# EasyEDA Pro project ProProject_训练营23_2023-12-06.epro, board PCB_PCB_不带频谱时钟_2_2023-11-23_1
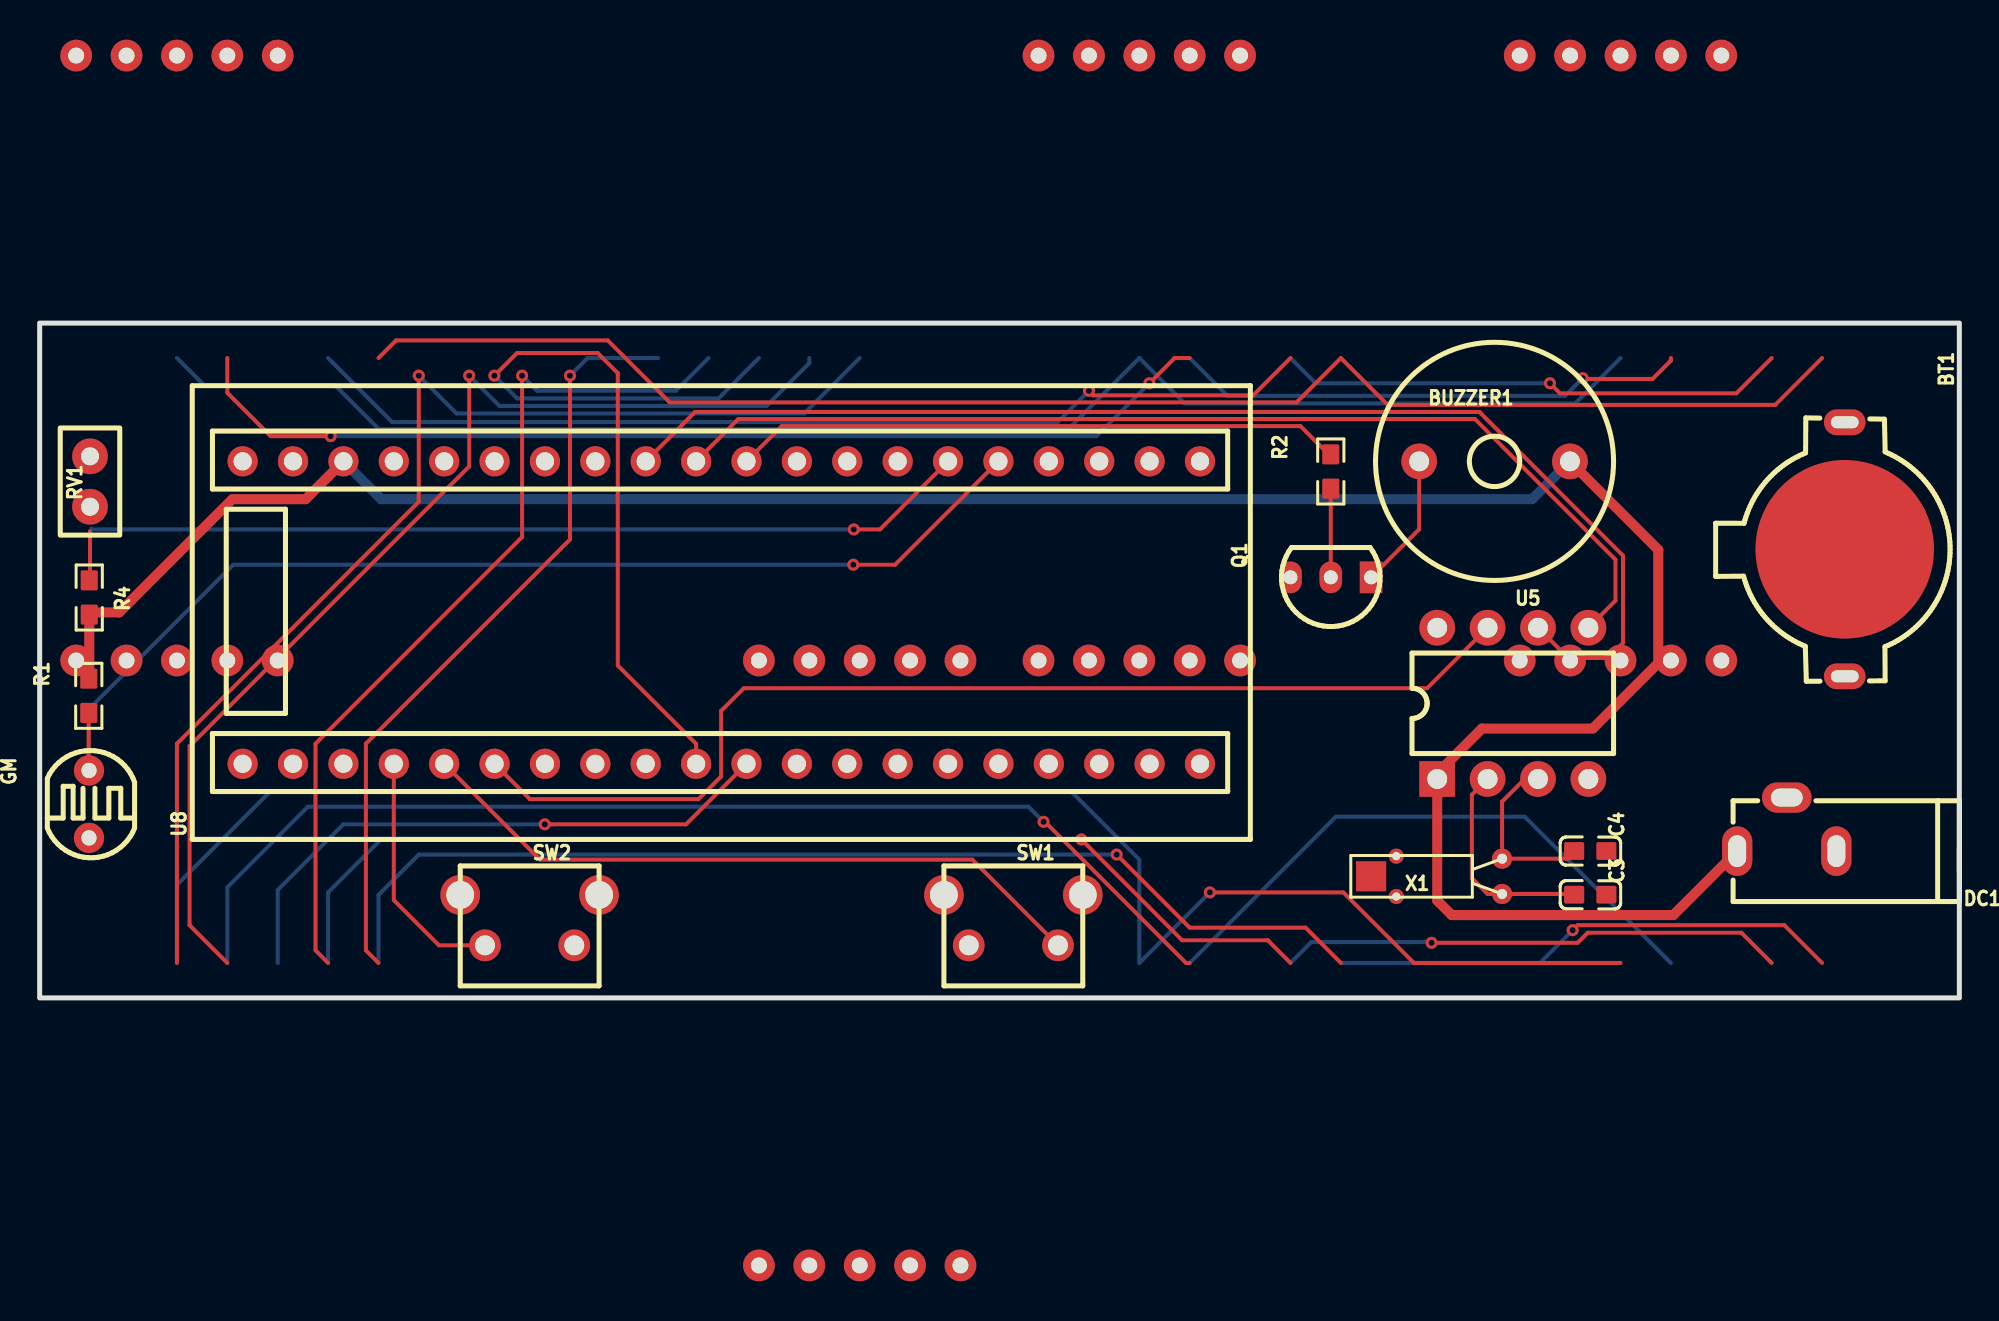
[diagram p1: board, top side]
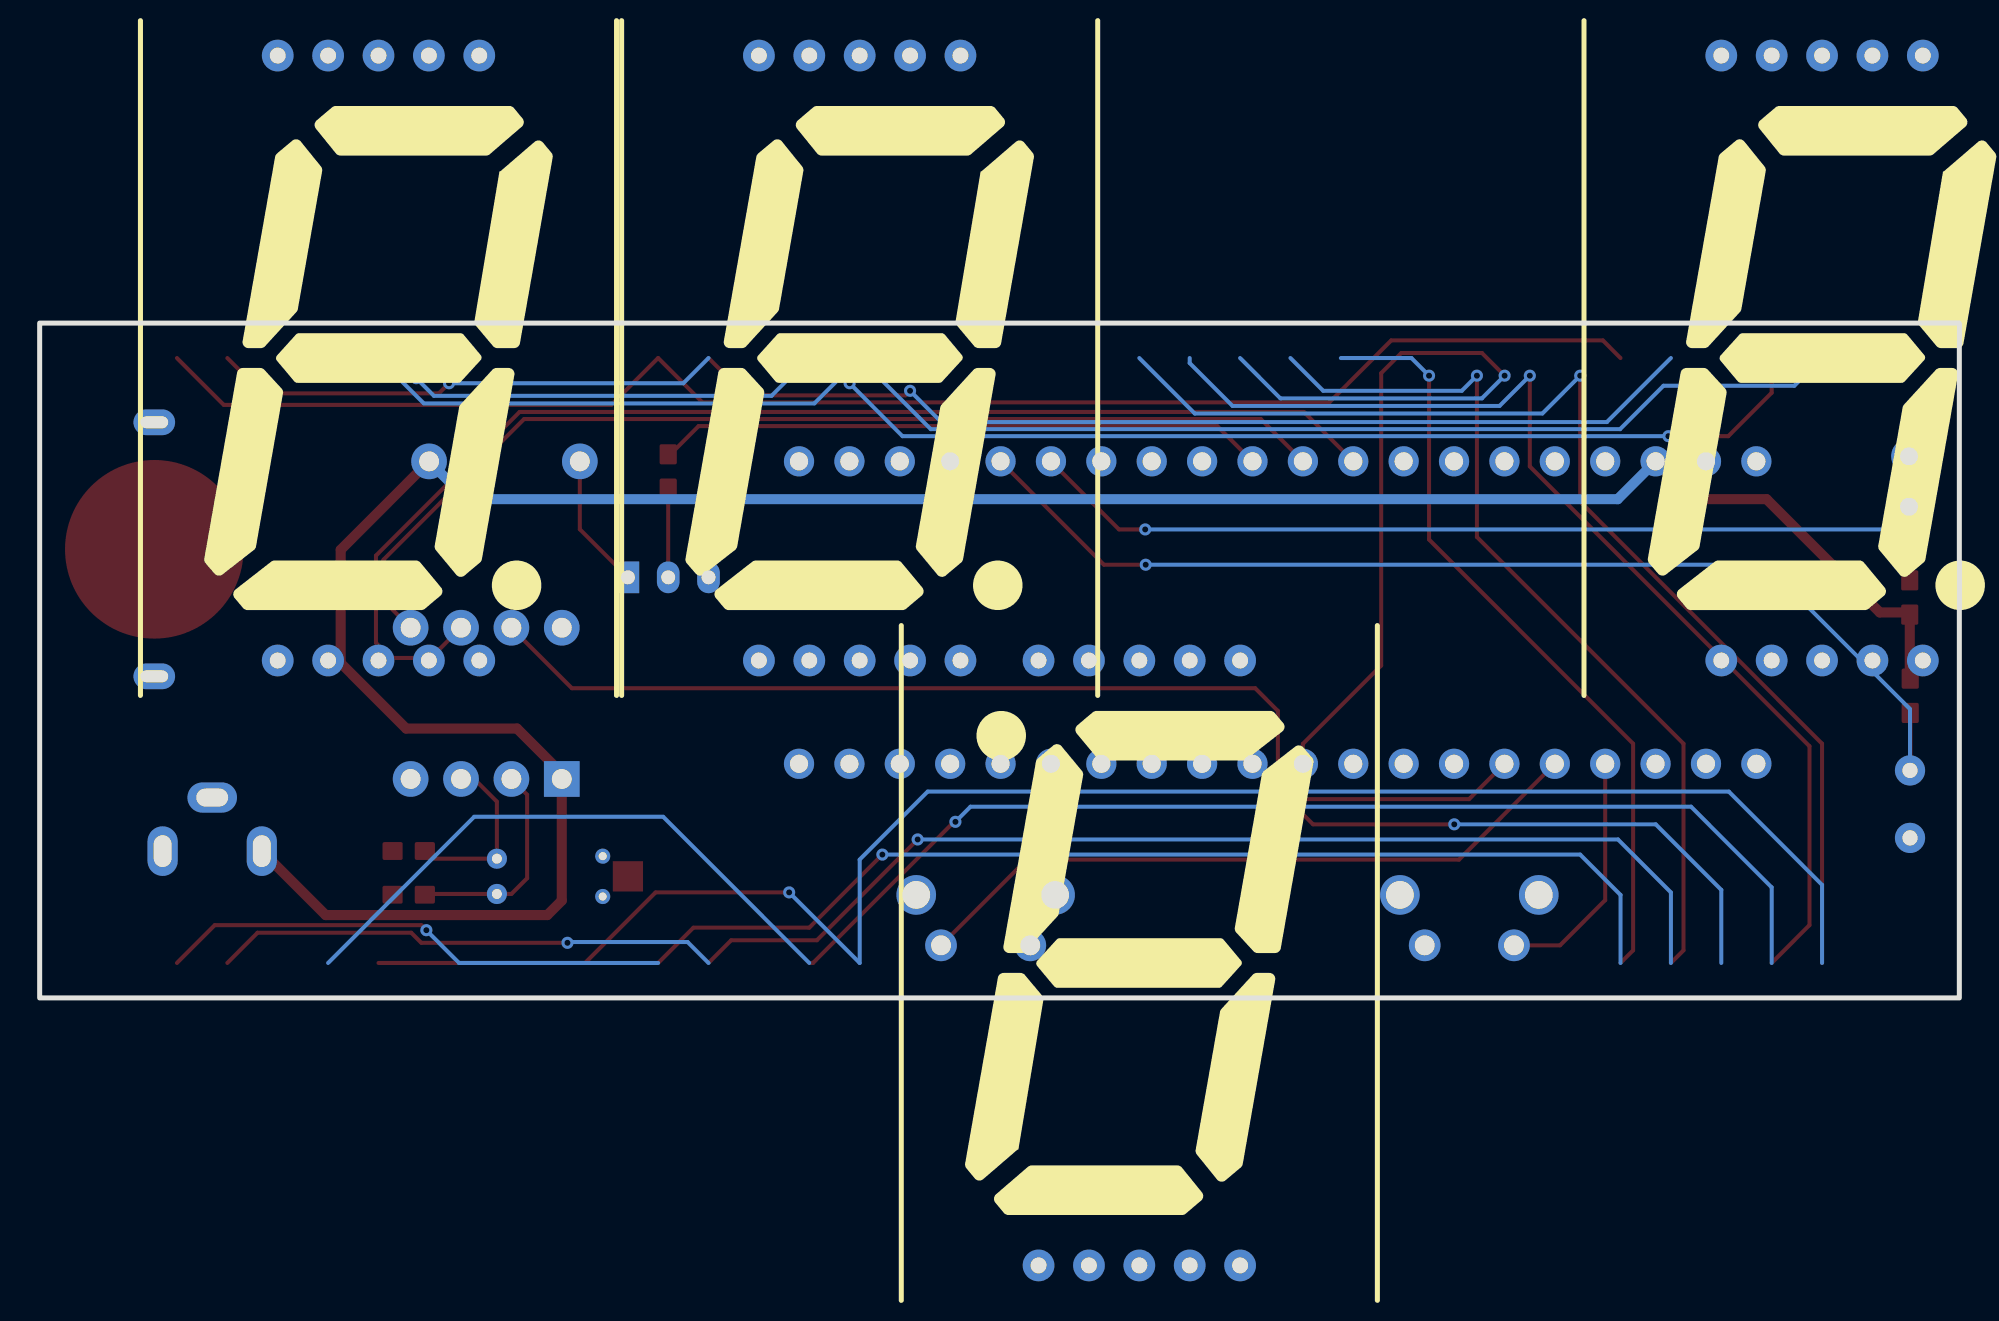
[diagram p2: board, bottom side, seen from below]

Outline 96.77 x 34 mm; copper layers: Top Layer, Bottom Layer. Coordinates in mm from the lower left corner of the outline.
Outline path: rectangle 0,34 96.77,0
Stack: Top Layer 0.035mm / Dielectric1 1.51mm FR4 er 4.5 / Bottom Layer 0.035mm

## Design rules (mm)
template: 用户自定义配置
spacing Default (default): track to track 0.152, other pairs 0 to 0.152
track width Default (default): min 0.152, default 0.203, max 25.4
differential pair differentialPair (default): width min 0.127, default 0.254, max 2.54; gap min 0.152, default 0.152
via Default (default): diameter min 0.61, default 0.61, max 100.025; hole min 0.305, default 0.305, max 59.995

## Placement (name value [footprint] x y rotation side)
BT1  MY-1220-01  [BAT-TH_MY-1220-01]  90.99 22.6 270 top
BUZZER1  2.3kHz  [BUZ-TH_BD12.0-P7.60-D0.6-FD]  73.34 27.03 180 top
C3  22pF  [C0603]  78.17 5.2 180 top
C4  22pF  [C0603]  78.17 7.4 180 top
DC1  DC-002-2.0A-1.65  [DC-IN_DC-002-2.0A-1.65]  88.07 8.74 180 top
GM  光敏电阻  [RES-TH_L5.1-W4.3-P3.40-D0.5]  2.49 9.76 0 top
LED1  -  [1寸数码管]  84.77 17 180 bottom
LED2  -  [1寸数码管]  60.51 17 180 bottom
LED3  -  [1寸数码管]  36.26 17 0 bottom
LED4  -  [1寸数码管]  12 17 180 bottom
Q1  2N6727  [TO-92-3_L4.9-W3.7-P1.27-L]  65.09 21.19 180 top
R1  10k  [R0603]  2.47 15.22 90 top
R2  10k  [R0603]  65.09 26.52 270 top
R4  10k  [R0603]  2.5 20.17 270 top
RV1  -  [热敏电阻]  2.54 26.02 270 top
SW1  SKHHLQA010  [KEY-TH_4P-SKHHLQA010]  49.08 3.92 0 top
SW2  SKHHLQA010  [KEY-TH_4P-SKHHLQA010]  24.7 3.92 0 top
U5  DS1302N  [DIP-8_L9.7-W6.4-P2.54-LS7.6-BL]  74.26 14.84 0 top
U8  -  [STM32F103C8T6核心板]  34.23 19.42 90 top
X1  32.768kHz  [CRYSTAL-TH_BD2.1-P0.70-D0.3]  73.72 6.12 0 top

## Footprints (pads in the part's own frame, mm; a bottom-side part is the same pattern mirrored in y, then rotated)
1寸数码管
  round 1.6 hole 0.8: 1(0,0) 2(2.54,0) 3(5.08,0) 4(7.62,0) 5(10.16,0) 6(10.16,30.48) 7(7.62,30.48) 8(5.08,30.48) 9(2.54,30.48) 10(0,30.48)
BAT-TH_MY-1220-01
  oval 1.3x2.1 hole 0.6x1.4: 1(-6.4,0) 1(6.4,0)
  round 9 smd: 2(0,0)
BUZ-TH_BD12.0-P7.60-D0.6-FD
  round 1.8 hole 1: 1(-3.8,0) 2(3.8,0)
C0603
  rrect 1.016x0.9 smd: 1(-0.813,0) 2(0.813,0)
CRYSTAL-TH_BD2.1-P0.70-D0.3
  oval 1.016x1.016 hole 0.5: 1(0,0.889) 2(0,-0.889)
  rect 1.524x1.524 smd: 3(-6.604,0)
  round 0.762 hole 0.406: 3(-5.334,1.016) 3(-5.334,-1.016)
DC-IN_DC-002-2.0A-1.65
  oval 1.524x2.5 hole 0.9x1.6: 1(2.5,1.35) 2(-2.5,1.35)
  oval 2.5x1.524 hole 1.6x0.9: 3(0,-1.35)
DIP-8_L9.7-W6.4-P2.54-LS7.6-BL
  rect 1.8x1.8 hole 1: 1(-3.81,-3.81)
  round 1.8 hole 1: 2(-1.27,-3.81) 3(1.27,-3.81) 4(3.81,-3.81) 5(3.81,3.81) 6(1.27,3.81) 7(-1.27,3.81) 8(-3.81,3.81)
KEY-TH_4P-SKHHLQA010
  round 1.6 hole 1: 1(-2.25,-1.27) 2(2.25,-1.27)
  round 2 hole 1.4: 3(3.5,1.27) 4(-3.5,1.27)
R0603
  rrect 1.016x0.864 smd: 1(-0.864,0) 2(0.864,0)
RES-TH_L5.1-W4.3-P3.40-D0.5
  round 1.524 hole 0.762x0.767: 1(0,-1.7) 2(0,1.7)
STM32F103C8T6核心板
  round 1.524 hole 0.914: 1(-7.62,23.993) 2(-7.62,21.453) 3(-7.62,18.913) 4(-7.62,16.373) 5(-7.62,13.833) 6(-7.62,11.293) 7(-7.62,8.753) 8(-7.62,6.213) 9(-7.62,3.673) 10(-7.62,1.133) 11(-7.62,-1.407) 12(-7.62,-3.947) 13(-7.62,-6.487) 14(-7.62,-9.027) 15(-7.62,-11.567) 16(-7.62,-14.107) 17(-7.62,-16.647) 18(-7.62,-19.187) 19(-7.62,-21.727) 20(-7.62,-24.267) 21(7.62,-24.267) 22(7.62,-21.727) 23(7.62,-19.187) 24(7.62,-16.647) 25(7.62,-14.107) 26(7.62,-11.567) 27(7.62,-9.027) 28(7.62,-6.487) 29(7.62,-3.947) 30(7.62,-1.407) 31(7.62,1.133) 32(7.62,3.673) 33(7.62,6.213) 34(7.62,8.753) 35(7.62,11.293) 36(7.62,13.833) 37(7.62,16.373) 38(7.62,18.913) 39(7.62,21.453) 40(7.62,23.993)
TO-92-3_L4.9-W3.7-P1.27-L
  rect 1.143x1.6 hole 0.7: 1(-2.032,0)
  oval 1.143x1.6 hole 0.7: 2(0,0) 3(2.032,0)
热敏电阻
  round 1.8 hole 0.905x0.9: 1(-1.27,0) 2(1.27,0)

## Nets
GND: BT1.2 C3.1 C4.1 DC1.2 DC1.3 GM.1 Q1.3 RV1.1 SW1.1 SW2.2 U5.4 U8.19 U8.20 U8.39
VCC: BUZZER1.1 DC1.1 R1.2 R4.2 U5.1 U8.38
A: LED1.7 LED2.7 LED3.7 LED4.7 U8.12
B: LED1.6 LED2.6 LED3.6 LED4.6 U8.13
C: LED1.4 LED2.4 LED3.4 LED4.4 U8.14
COM1: LED1.3 LED1.8 U8.8
COM2: LED2.3 LED2.8 U8.9
COM3: LED3.3 LED3.8 U8.10
COM4: LED4.3 LED4.8 U8.11
D: LED1.2 LED2.2 LED3.2 LED4.2 U8.15
DP: LED1.5 LED2.5 LED3.5 LED4.5 U8.22
E: LED1.1 LED2.1 LED3.1 LED4.1 U8.16
F: LED1.9 LED2.9 LED3.9 LED4.9 U8.17
G: LED1.10 LED2.10 LED3.10 LED4.10 U8.21
GM: GM.2 R1.1 U8.25
P0.0: U5.5 U8.31
P0.1: U5.6 U8.32
P1.7: R2.1 U8.30
P3.0: SW2.1 U8.4
P3.1: SW1.2 U8.5
P3.2: U5.7 U8.6
RM: R4.1 RV1.2 U8.26
$1N45: BUZZER1.2 Q1.1
$1N46: Q1.2 R2.2
$1N120: BT1.1 U5.8
$1N175: C3.2 U5.2 X1.2
$1N176: C4.2 U5.3 X1.1

Pads without a net: SW1 3 4; SW2 3 4; U8 1 2 3 7 18 23 24 27 28 29 33 34 35 36 37 40; X1 3

## Via types
v1: diameter 0.61, hole 0.305, Top Layer to Bottom Layer, 19 vias

## Routing (per net, layer and track width the routed paths; a pad name or vN(x,y) marks a point on that pad's centre or on a via; arc(x,y) is an arc through that point)
GND: length 0
  Top Layer w0.203: 78.87,5.2 78.86,5.19
VCC: length 131.5
  Top Layer w0.508: 15.31,27.04 13.4,25.13 9.71,25.13 4.01,19.42 2.5,19.42 2.5,16.08 2.4,15.98 ; DC1.1 82.35,4.17 71.18,4.17 70.45,4.9 U5.1 70.45,11.32 72.71,13.57 78.29,13.57 81.6,16.87 81.6,22.58 BUZZER1.1
  Bottom Layer w0.508: BUZZER1.1 75.24,25.13 17.22,25.13 15.31,27.04
A: length 78.7
  Top Layer w0.203: v1(77.79,31.22) 77.82,31.19 81.3,31.19 82.23,32.11 82.23,32.24 ; 9.46,32.24 9.46,30.49 11.65,28.3 v1(14.67,28.3) ; v1(55.94,30.97) 57.21,32.24 57.97,32.24
  Bottom Layer w0.203: v1(14.67,28.3) 53.27,28.3 v1(55.94,30.97) ; 57.97,32.24 59.88,30.33 76.9,30.33 v1(77.79,31.22)
B: length 77.6
  Bottom Layer w0.203: 6.92,32.24 8.32,30.84 14.91,30.84 17.1,28.66 51.85,28.66 55.43,32.24 57.72,29.95 77.4,29.95 79.69,32.24
C: length 142.8
  Top Layer w0.203: v1(50.61,8.87) 50.67,8.87 57.79,1.76 57.97,1.76 ; v1(21.65,31.35) 21.65,26.78 7.55,12.68 7.55,3.66 9.46,1.76
  Bottom Layer w0.203: v1(50.61,8.87) 49.85,9.63 13.52,9.63 9.46,5.57 9.46,1.76 ; 82.23,1.76 74.86,9.13 65.34,9.13 57.97,1.76 ; 38.8,32.24 38.8,31.99 36.64,29.83 23.18,29.83 v1(21.65,31.35)
COM3: length 43.1
  Top Layer w0.203: v1(22.92,31.35) 24.06,32.49 28.13,32.49 29.14,31.48 29.14,16.75 33.09,12.8 U8.10
  Bottom Layer w0.203: v1(22.92,31.35) 24.06,30.21 34.23,30.21 36.26,32.24
COM4: length 29.9
  Top Layer w0.203: 35.63,11.8 32.58,8.74 v1(25.46,8.74)
  Bottom Layer w0.203: 12,1.76 12,5.44 15.3,8.74 v1(25.46,8.74)
D: length 125.9
  Top Layer w0.203: v1(52.51,7.98) 57.59,2.9 61.91,2.9 63.05,1.76 ; v1(70.17,2.78) 77.53,2.78 78.04,3.28 85.79,3.28 87.31,1.76 ; v1(24.32,31.35) 24.32,23.22 13.91,12.81 13.91,2.39 14.54,1.76
  Bottom Layer w0.203: v1(70.17,2.78) 70.13,2.81 64.11,2.81 63.05,1.76 ; v1(24.32,31.35) 25.08,30.59 32.07,30.59 33.72,32.24 ; v1(52.51,7.98) 17.21,7.98 14.54,5.32 14.54,1.76
DP: length 147
  Top Layer w0.203: v1(19.11,31.35) 19.11,25 6.92,12.81 6.92,1.76 ; 79.69,1.76 69.28,1.76 65.72,5.32 v1(58.99,5.32)
  Bottom Layer w0.203: 41.34,32.24 38.54,29.45 21.02,29.45 v1(19.11,31.35) ; 6.92,1.76 6.92,5.7 11.62,10.4 52.01,10.4 55.43,6.97 55.43,1.76 v1(58.99,5.32)
E: length 119.8
  Top Layer w0.203: 65.59,1.76 63.82,3.54 57.97,3.54 v1(54.29,7.22) ; v1(26.73,31.35) 26.73,23.1 16.44,12.81 16.44,2.39 17.08,1.76 ; 89.85,1.76 87.95,3.66 77.53,3.66 v1(77.28,3.41)
  Bottom Layer w0.203: 31.18,32.24 27.62,32.24 v1(26.73,31.35) ; v1(77.28,3.41) 75.63,1.76 65.59,1.76 ; v1(54.29,7.22) 19.11,7.22 17.08,5.19 17.08,1.76
F: length 77.1
  Top Layer w0.203: 63.05,32.24 61.17,30.36 53.12,30.36 v1(52.89,30.59) ; 87.31,32.24 85.53,30.46 76.64,30.46 v1(76.14,30.97)
  Bottom Layer w0.203: 63.05,32.24 64.32,30.97 v1(76.14,30.97) ; 14.54,32.24 17.77,29.01 51.32,29.01 v1(52.89,30.59)
G: length 77.3
  Top Layer w0.203: 89.85,32.24 87.49,29.88 67.96,29.88 65.59,32.24 63.36,30 31.76,30 28.64,33.13 17.97,33.13 17.08,32.24
GM: length 57.2
  Top Layer w0.203: 2.4,14.47 2.47,14.4 2.47,11.53 2.4,11.46 ; U8.25 43.12,21.83 v1(41.02,21.83)
  Bottom Layer w0.203: GM.2 2.49,14.56 9.76,21.83 v1(41.02,21.83)
P0.0: length 54.2
  Top Layer w0.203: U5.5 79.44,20.02 79.44,22.08 72.35,29.17 35.22,29.17 33.09,27.04 U8.31
P0.1: length 62.9
  Top Layer w0.203: U5.6 77.05,17.13 79.06,17.13 79.82,17.89 79.82,22.28 72.58,29.52 33.04,29.52 U8.32
P1.7: length 30.8
  Top Layer w0.203: 65.09,27.28 63.55,28.81 37.41,28.81 35.63,27.04
P3.0: length 12.4
  Top Layer w0.203: SW2.1 20.13,2.65 17.85,4.92 U8.4
P3.1: length 34.7
  Top Layer w0.203: 20.39,11.8 25.22,6.97 47.02,6.97 SW1.2
P3.2: length 56.3
  Top Layer w0.203: U5.7 69.94,15.6 35.49,15.6 34.35,14.46 34.35,11.16 33.21,10.02 24.71,10.02 U8.6
RM: length 47.2
  Top Layer w0.203: v1(41.04,23.6) 42.36,23.6 45.79,27.04 ; 2.54,23.52 2.54,20.97 2.5,20.93
  Bottom Layer w0.203: v1(41.04,23.6) 2.64,23.6 2.6,23.64
$1N45: length 6.8
  Top Layer w0.203: Q1.1 69.54,23.61 BUZZER1.2
$1N46: length 4.6
  Top Layer w0.203: 65.09,25.77 Q1.2
$1N175: length 10.9
  Top Layer w0.203: 77.47,5.2 77.43,5.24 X1.2 72.99,5.24 72.2,6.03 72.2,10.24 U5.2
$1N176: length 9.1
  Top Layer w0.203: U5.3 74.86,11.03 73.72,9.89 X1.1 77.08,7.01 77.47,7.4
